# Altium project MD029A.PrjPcb (part 1 of 3)
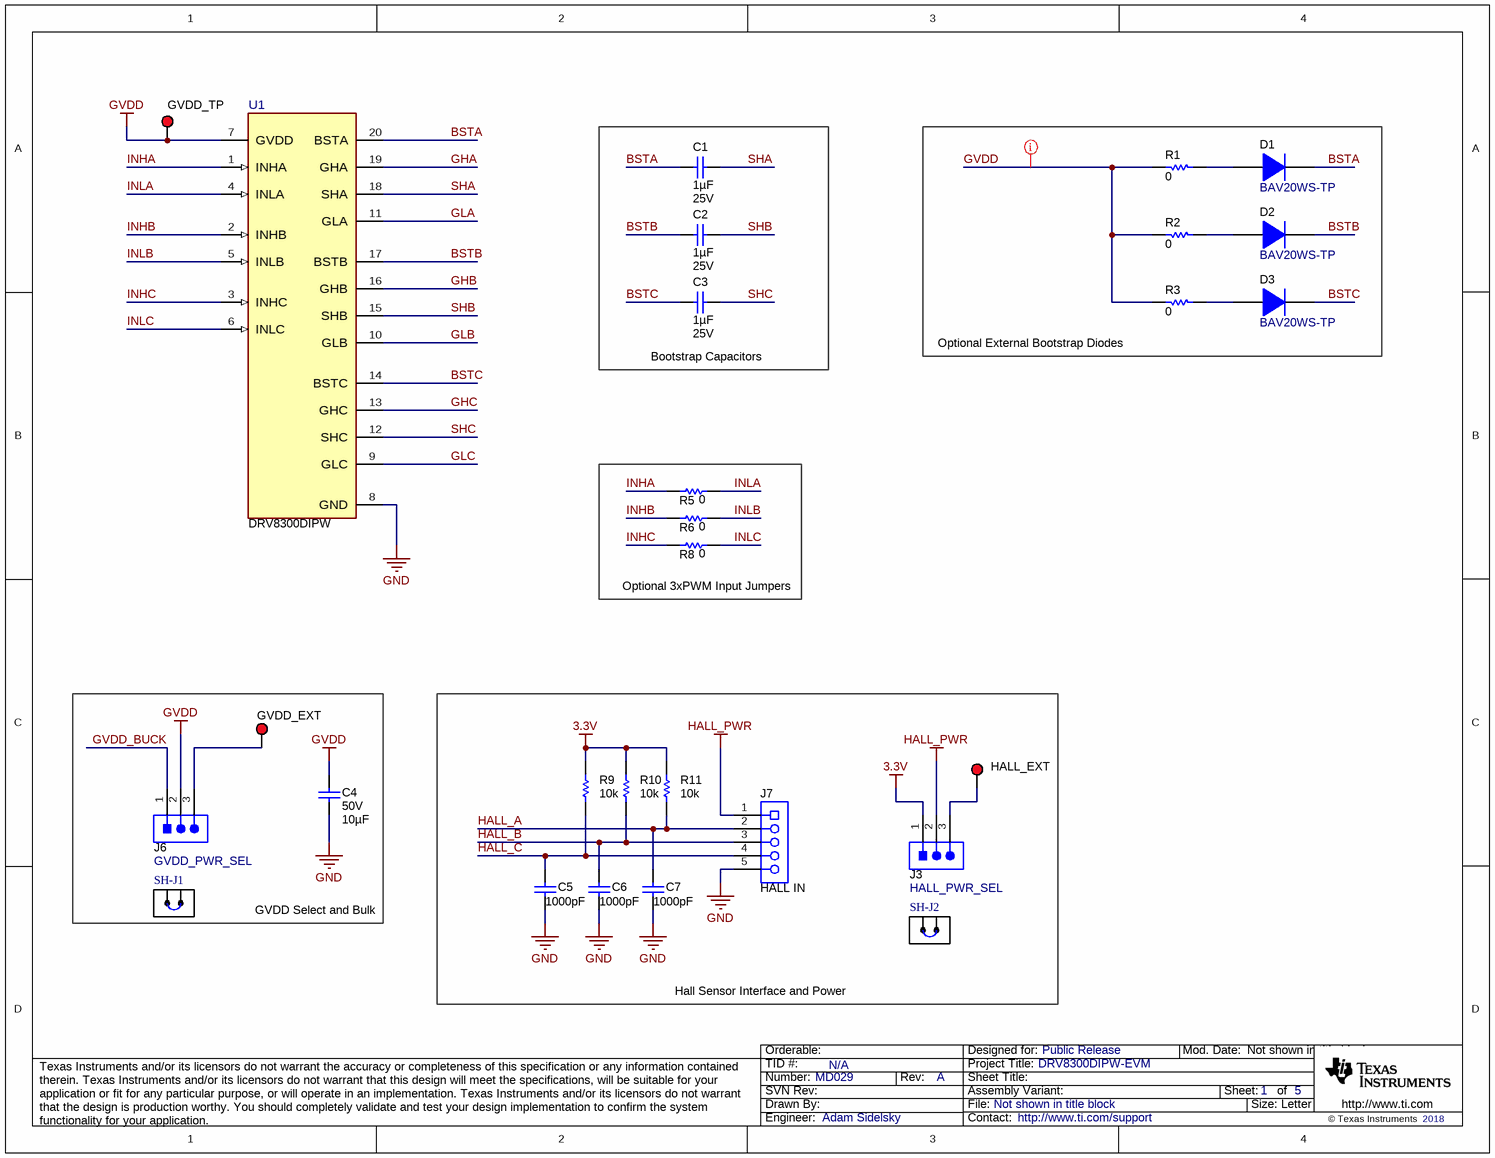
[diagram p0: MD029A_DRV8300.SchDoc]
CopyrightYear: 2018; PCB_Layout: Adam Sidelsky; PCB_Rev: A; PRJ_Customer: Public Release; PRJ_Engineer: Adam Sidelsky; PRJ_Number: MD029; PRJ_Title: DRV8300DIPW-EVM; SCH_Rev: A; TechSupport: http://www.ti.com/support; TID: N/A
5 sheets, 226 parts. Net scope: global (net labels, ports and power ports of the same name join across sheets).
Board file: MD029A.PcbDoc
Sheets:
  MD029A_DRV8300.SchDoc
  MD029A_HalfBridges.SchDoc
  MD029A_CSA.SchDoc
  MD029A_Power.SchDoc
  MD029A_Hardware.SchDoc

## Sheet MD029A_DRV8300.SchDoc
size Letter; Date: Not shown in title block; ApprovedBy: Not shown in title block; CheckedBy: Not shown in title block; Author: Not shown in title block; CompanyName: Not shown in title block; Engineer: Not shown in title block; Organization: Not shown in title block; Address1: Not shown in title block; Address2: Not shown in title block; Address3: Not shown in title block; Address4: Not shown in title block; DocumentNumber: 1; Revision: Use project parameter SCH_Rev; SheetNumber: 1; SheetTotal: 5; PageSetup: Record=PageOptions|CenterHorizontal=True|CenterVertical=True|PrintScale=1.00|XCorrection=1.00|YCorrection=1.00|PrintKind=0|BorderSize=5000000|LeftOffset=0|BottomOffset=0|Orientation=2|PaperLength=1000|PaperWidth=1000|Scale=100|PaperSource=15|PrintQuality=600|MediaType=1|DitherType=10|PaperKind=Letter|PrintScaleMode=1; CurrentTime: Not shown in title block; CurrentDate: Not shown in title block; Time: Not shown in title block; DocumentFullPathAndName: Not shown in title block; DocumentName: Not shown in title block; ModifiedDate: Not shown in title block; ImagePath: Not shown in title block

### Parts
C1  Cap_F: 1µF  VDC_V: 25V  [0805L]  (hidden comment: CL21B105KAFNNNE)
C2  Cap_F: 1µF  VDC_V: 25V  [0805L]  (hidden comment: CL21B105KAFNNNE)
C3  Cap_F: 1µF  VDC_V: 25V  [0805L]  (hidden comment: CL21B105KAFNNNE)
C4  VDC_V: 50V  ValueDisplayed: 10µF  [1210_270L]  (hidden comment: CL32B106KBJNNWE)
C5  ValueDisplayed: 1000pF  [0603L]  (hidden comment: 885012206034)
C6  ValueDisplayed: 1000pF  [0603L]  (hidden comment: 885012206034)
C7  ValueDisplayed: 1000pF  [0603L]  (hidden comment: 885012206034)
D1  BAV20WS-TP  [SOD-323]
D2  BAV20WS-TP  [SOD-323]
D3  BAV20WS-TP  [SOD-323]
GVDD_EXT  (no value)  [Keystone5000]
GVDD_TP  (no value)  [Keystone5000]
HALL_EXT  (no value)  [Keystone5000]
J3  HALL_PWR_SEL  [WURTH_61300311121]
J6  GVDD_PWR_SEL  [WURTH_61300311121]
J7  HALL IN  [Phoenix_1792892]
R1  ValueDisplayed: 0  [0805L]  (hidden comment: CRCW08050000Z0EAHP)
R2  ValueDisplayed: 0  [0805L]  (hidden comment: CRCW08050000Z0EAHP)
R3  ValueDisplayed: 0  [0805L]  (hidden comment: CRCW08050000Z0EAHP)
R5  value 0  [0603L]  (hidden comment: CRCW06030000Z0EA)
R6  value 0  [0603L]  (hidden comment: CRCW06030000Z0EA)
R8  value 0  [0603L]  (hidden comment: CRCW06030000Z0EA)
R9  value 10k  [0603L]  (hidden comment: CRCW060310K0JNEA)
R10  value 10k  [0603L]  (hidden comment: CRCW060310K0JNEA)
R11  value 10k  [0603L]  (hidden comment: CRCW060310K0JNEA)
SH-J1  SNT-100-BK-G  [SNT-100-BK-G]  (value not drawn)
SH-J2  SNT-100-BK-G  [SNT-100-BK-G]  (value not drawn)
U1  DRV8300DIPW  [PW0020A-MFG]

### Blocks framed on the sheet
Bootstrap Capacitors: C1-C3
Optional External Bootstrap Diodes: D1-D3 R1-R3
Optional 3xPWM Input Jumpers: R5 R6 R8
GVDD Select and Bulk: C4 GVDD_EXT J6 SH-J1
Hall Sensor Interface and Power: C5-C7 HALL_EXT J3 J7 R9-R11 SH-J2

### Nets
3.3V: J3.1 R9.1 R10.1 R11.1
GND: C4.2 C5.2 C6.2 C7.2 J7.5 U1.8(GND)
GVDD: C4.1 GVDD_TP.1 J6.2 R1.2 R2.2 R3.2 U1.7(GVDD)
HALL_PWR: J3.2 J7.1
BSTA: C1.2 D1.1(K) U1.20(BSTA)
BSTB: C2.2 D2.1(K) U1.17(BSTB)
BSTC: C3.2 D3.1(K) U1.14(BSTC)
GHA: U1.19(GHA)
GHB: U1.16(GHB)
GHC: U1.13(GHC)
GLA: U1.11(GLA)
GLB: U1.10(GLB)
GLC: U1.9(GLC)
GVDD_BUCK: J6.1
HALL_A: C7.1 J7.2 R11.2
HALL_B: C6.1 J7.3 R10.2
HALL_C: C5.1 J7.4 R9.2
INHA: R5.2 U1.1(INHA)
INHB: R6.2 U1.2(INHB)
INHC: R8.2 U1.3(INHC)
INLA: R5.1 U1.4(INLA)
INLB: R6.1 U1.5(INLB)
INLC: R8.1 U1.6(INLC)
SHA: C1.1 U1.18(SHA)
SHB: C2.1 U1.15(SHB)
SHC: C3.1 U1.12(SHC)
NetD1_2: D1.2(A) R1.1
NetD2_2: D2.2(A) R2.1
NetD3_2: D3.2(A) R3.1
NetGVDD_EXT_1: GVDD_EXT.1 J6.3
NetHALL_EXT_1: HALL_EXT.1 J3.3

### Layout directives
net class 2.5A: GVDD

### Notes on the sheet
- Drawn By:
- SVN Rev:
- Number:
- TID #:
- Orderable:
- Rev:
- Sheet Title:
- File:
- Project Title:
- Designed for:
- Assembly Variant:
- Mod. Date:
- Sheet:
- Size:
- of
- Letter
- http://www.ti.com
- Texas Instruments and/or its licensors do not warrant the accuracy or completeness of this specification or any information contained therein. Texas Instruments and/or its licensors do not warrant that this design will meet the specifications, will be suitable for your application or fit for any particular purpose, or will operate in an implementation. Texas Instruments and/or its licensors do not warrant that the design is production worthy. You should completely validate and test your design implementation to confirm the system functionality for your application.
- Engineer:
- Contact:
- © Texas Instruments

### Library data of the parts
C1-C3 = CMP-0083859-1: CAP, CERM, 1 µF, 25 V,+/- 10%, X7R, 0805; Manufacturer: Samsung Electro-Mechanics; TaMin_C: -55°C; Polarized: N; Green_Lifecycle: Active; SizeAreaWB_mm2: 6.75; Green_REACh: Passed; U/M: EA; Value: 1uF; TaMax_C: 125°C; SizeZ_mm: 1.45; SizeX_mm: 2; SizeY_mm: 1.25; Cap_Case: 0805; SizeArea_mm2: 2.5; AEC Category: Q200; ComponentLink1URL: http://www.samsungsem.com/kr/support/product-search/mlcc/CL21B105KAFNNNE.jsp; TempCo: X7R; RoHS: Y; MountType: SMT; Green_EU RoHS-2: Passed; Green_EU RoHS: Passed; PackageReference: 0805; Tolerance_%: 10%; Value2: 25V; CompType: Capacitor; PartNumber: CL21B105KAFNNNE; AEC Qualified: N; ComponentLink1Description: Datasheet link; AEC Grade: N/A; Technology: Ceramic; ValueDisplayed: 1µF
C4 = CMP-0079201-1: CAP, CERM, 10 µF, 50 V,+/- 10%, X7R, 1210; Manufacturer: Samsung Electro-Mechanics; TaMin_C: -55°C; ESR_ohm: 5m; Polarized: N; SizeAreaWB_mm2: 14.7; Value1: 0.005 ohm; U/M: EA; Value: 10uF; TaMax_C: 125°C; SizeZ_mm: 2.7; SizeX_mm: 3.2; SizeY_mm: 2.5; Cap_Case: 1210; SizeArea_mm2: 8; AEC Category: Q200; ComponentLink1URL: http://www.samsungsem.com/kr/support/product-search/mlcc/__icsFiles/afieldfile/2016/08/18/S_CL32B106KBJNNWE.pdf; TempCo: X7R; RoHS: Y; MountType: SMT; Supplier 1: Digi-Key; PackageReference: 1210; Tolerance_%: 10%; Value2: 50V; CompType: Capacitor; PartNumber: CL32B106KBJNNWE; AEC Qualified: N; Cap_F: 10µF; ComponentLink1Description: Datasheet link; AEC Grade: N/A; Supplier Part Number 1: 1276-3388-1-ND; Technology: Ceramic
C5-C7 = CMP-0006826-4: CAP, CERM, 1000 pF, 16 V, +/- 10%, X7R, 0603; Manufacturer: Wurth Elektronik; TaMin_C: -55°C; Polarized: N; SizeAreaWB_mm2: 4.68; Value1: Unknown; U/M: EA; Value: 1000pF; TaMax_C: 125°C; SizeZ_mm: 1; SizeX_mm: 1.6; SizeY_mm: 0.8; Cap_Case: 0603; Value2: 16V; SizeArea_mm2: 1.28; CompType: Capacitor; Cap_F: 1nF; AEC Category: Q200; Publisher: Texas Instruments; TempCo: X7R; Published: 2008-06-19; RoHS: Y; MountType: SMT; Supplier 1: Mouser; PackageReference: 0603; Tolerance_%: 10%; LatestRevisionDate: 2017-03-09; PartNumber: 885012206034; AEC Qualified: N; ComponentLink1Description: Datasheet link; AEC Grade: N/A; Supplier Part Number 1: 710-885012206034; Technology: Ceramic; ComponentLink1URL: http://katalog.we-online.de/pbs/datasheet/885012206034.pdf
D1-D3 = CMP-0029044-2: Diode, P-N, 150 V, 0.2 A, SOD-323; Manufacturer: Micro Commercial Components; Value2: 1.25V; AEC Category: Q101; SizeArea_mm2: 3.645; Vr_V: 150V; Green_REACh: Incomplete; SizeZ_mm: 1; Green_Lifecycle: Not Set; TJmax_C: 150°C; SizeAreaWB_mm2: 8.695; Value1: 0.2A; SizeX_mm: 2.7; Io_A: 200mA; SizeY_mm: 1.35; Value: 150V; PartNumber: BAV20WS-TP; AEC Qualified: ?; ComponentLink1URL: http://www.mccsemi.com/up_pdf/BAV19WS-BAV21WS(SOD-323).PDF; PackageReference: SOD-323; Vf_V: 1.25V; RoHS: Y; CompType: Diode; MountType: SMT; Type: P-N; Green_EU RoHS-2: Incomplete; Green_EU RoHS: Incomplete; ComponentLink1Description: Datasheet link
GVDD_EXT GVDD_TP HALL_EXT = CMP-0055137-1: Test Point, Miniature, Red, TH; PartNumber: 5000; Manufacturer: Keystone; ContactFinish: Silver; CNHeader: FALSE; CT: TRUE; Green_Lifecycle: Active; Green_REACh: Passed; PackageReference: Red Miniature Testpoint; CompType: Test Point; RoHS: Y; MountType: TH; ComponentLink1Description: Datasheet URL; ComponentLink1URL: http://www.keyelco.com/userAssets/file/M60-2p60.pdf; Publisher: Texas Instruments; LatestRevisionDate: 26/05/2017; Supplier 1: Digi-Key; Supplier Part Number 1: 36-5000-ND; Supplier 2: Mouser; Supplier Part Number 2: 534-5000; Color: Red; Green_EU RoHS-2: Incomplete; Green_EU RoHS: Passed
J3 J6 = CMP-0054796-2: Header, 2.54 mm, 3x1, Gold, TH; Manufacturer: Wurth Elektronik; PartNumber: 61300311121; Green_Lifecycle: Active; Green_REACh: Passed; Cert_UL: Y; Gender: Male; Pitch_mm: 2.54; Row_Count: 1; Shrouded: N; ComponentLink1URL: http://katalog.we-online.de/em/datasheet/6130xx11121.pdf; ClassName: Header; Supplier Part Number 2: 20X0950; Supplier 2: Newark; Supplier Part Number 3: 356154; Supplier 3: Farnell; RoHS: Y; MountType: TH; Green_EU RoHS-2: Incomplete; Supplier 1: Digi-Key; Green_EU RoHS: Passed; PackageReference: Header, 2.54mm, 3x1, TH; CompType: Header; ComponentLink1Description: Datasheet URL; Supplier Part Number 1: 732-5316-ND; Color: Black; ContactFinish: Gold; Orientation: Vertical; PinCount: 3
J7 = CMP-0055532-1: Terminal Block, 5mm, 5x1, R/A, TH; Manufacturer: Phoenix Contact; PartNumber: 1792892; Cert_VDE: Y; CNHeader: FALSE; Current_A: 16A; Gender: Female; Voltage_V: 400V; Row_Count: 1; Pitch_mm: 5; CT: TRUE; ComponentLink1URL: https://www.phoenixcontact.com/online/portal/pi?uri=pxc-oc-itemdetail:pid=1792892&library=pien&pcck=P-11-01-05&tab=1; Supplier Part Number 2: 78T0423; Publisher: Texas Instruments; Supplier 2: Newark; Supplier Part Number 3: 651-1792892; Color: Green; Supplier 3: Mouser; Cert_CULUS: Y; RoHS: Y; MountType: TH; Supplier 1: Digi-Key; PackageReference: Terminal Block, 5mm, 5x1, R/A, TH; PinCount: 5; CompType: Terminal Block; LatestRevisionDate: 26/05/2017; Orientation: R/A; ComponentLink1Description: Datasheet URL; Supplier Part Number 1: 277-2521-ND; Cert_UL: Y
R1-R3 = CMP-0020443-3: RES, 0, 5%, 0.333 W, AEC-Q200 Grade 0, 0805; Manufacturer: Vishay-Dale; Power_W: 333mW; TempCo: 200 ppm/C; Value_Code: 0000; Value: 0; EIA_Code: E24; SizeX_mm: 2; SizeY_mm: 1.25; SizeZ_mm: 1.45; Value2: 0.333W; SizeArea_mm2: 2.5; AEC Qualified: Y; AEC Category: Q200; VDC_V: 150V; Supplier Part Number 2: 68R2993; Supplier 2: Newark; Supplier Part Number 3: 71-CRCW08050000Z0EAH; Supplier 3: Mouser; RoHS: E; Value1: 5%; MountType: SMT; Supplier 1: Digi-Key; PackageReference: 0805; Tolerance_%: 5%; Res_ohm: 0; CompType: Resistor; PartNumber: CRCW08050000Z0EAHP; ComponentLink1Description: Datasheet link; Supplier Part Number 1: 541-0.0TBCT-ND; Technology: Thick Film; ComponentLink1URL: http://www.vishay.com/docs/20043/crcwhpe3.pdf; AEC Grade: 0
R5 R6 R8 = CMP-0025697-4: RES, 0, 5%, 0.1 W, AEC-Q200 Grade 0, 0603; Manufacturer: Vishay-Dale; Value_Code: 0000; Power_W: 100mW; Value2: 0.1W; VDC_V: 75V; TempCo: 200 ppm/C; EIA_Code: E24; AEC Category: Q200; AEC Qualified: Y; SizeArea_mm2: 1.28; SizeX_mm: 1.6; SizeY_mm: 0.8; SizeZ_mm: 1; CompType: Resistor; PartNumber: CRCW06030000Z0EA; PackageReference: 0603; RoHS: E; Res_ohm: 0; Tolerance_%: 5%; Value1: 5%; MountType: SMT; Technology: Thick Film; ComponentLink1Description: Datasheet link; ComponentLink1URL: http://www.vishay.com/docs/20035/dcrcwe3.pdf; Supplier 1: Digi-Key; Supplier Part Number 1: 541-0.0GCT-ND; Supplier 2: Newark; Supplier Part Number 2: 52K8014; Supplier 3: Mouser; Supplier Part Number 3: 71-CRCW0603-0-E3; ValueDisplayed: 0; AEC Grade: 0
R9-R11 = CMP-0025701-4: RES, 10 k, 5%, 0.1 W, AEC-Q200 Grade 0, 0603; Manufacturer: Vishay-Dale; Value_Code: 10k0; Power_W: 100mW; Value2: 0.1W; VDC_V: 75V; TempCo: 200 ppm/C; EIA_Code: E24; AEC Category: Q200; AEC Qualified: Y; AEC Grade: 0; SizeArea_mm2: 1.28; SizeX_mm: 1.6; SizeY_mm: 0.8; SizeZ_mm: 1; CompType: Resistor; PartNumber: CRCW060310K0JNEA; PackageReference: 0603; RoHS: E; Res_ohm: 10k; Tolerance_%: 5%; Value1: 5%; MountType: SMT; Technology: Thick Film; ComponentLink1Description: Datasheet link; ComponentLink1URL: http://www.vishay.com/docs/20035/dcrcwe3.pdf; Supplier 1: Digi-Key; Supplier Part Number 1: 541-10KGCT-ND; Supplier 2: Newark; Supplier Part Number 2: 52K8066; Supplier 3: Mouser; Supplier Part Number 3: 71-CRCW0603J-10K-E3; ValueDisplayed: 10k
SH-J1 SH-J2 = CMP-0003623-3: Shunt, 100mil, Gold plated, Black; Alternate PartNumber: 969102-0000-DA; Manufacturer: Samtec; Alternate Manufacturer: 3M; Value: 1x2; ComponentLink1URL: http://www.samtec.com/ftppub/pdf/SNT.PDF; Supplier 1: Digi-Key; CompType: Shunt; PackageReference: Shunt; ClassName: Shunt; RoHS: Y; Supplier Part Number 1: SAM8858-ND; MountType: N/A; PartNumber: SNT-100-BK-G; ComponentLink1Description: Datasheet Link
U1 = CMP-0089052-1: Three-Phase BLDC Gate Driver; Manufacturer: Texas Instruments; AEC Qualified: No; SizeZ_mm: 1.2mm; Operating Temperature Range: -40°C to +150°C; PartNumber: DRV8300DIPW; RoHS: UNKNOWN; PackageReference: TSSOP20

## Sheet MD029A_HalfBridges.SchDoc
size Letter; Date: Not shown in title block; ApprovedBy: Not shown in title block; CheckedBy: Not shown in title block; Author: Not shown in title block; CompanyName: Not shown in title block; Engineer: Not shown in title block; Organization: Not shown in title block; Address1: Not shown in title block; Address2: Not shown in title block; Address3: Not shown in title block; Address4: Not shown in title block; DocumentNumber: 2; Revision: Use project parameter SCH_Rev; SheetNumber: 2; SheetTotal: 5; PageSetup: Record=PageOptions|CenterHorizontal=True|CenterVertical=True|PrintScale=1.00|XCorrection=1.00|YCorrection=1.00|PrintKind=0|BorderSize=5000000|LeftOffset=0|BottomOffset=0|Orientation=2|PaperLength=1000|PaperWidth=1000|Scale=100|PaperSource=15|PrintQuality=600|MediaType=1|DitherType=10|PaperKind=Letter|PrintScaleMode=1; CurrentTime: Not shown in title block; CurrentDate: Not shown in title block; Time: Not shown in title block; DocumentFullPathAndName: Not shown in title block; DocumentName: Not shown in title block; ModifiedDate: Not shown in title block; ImagePath: Not shown in title block
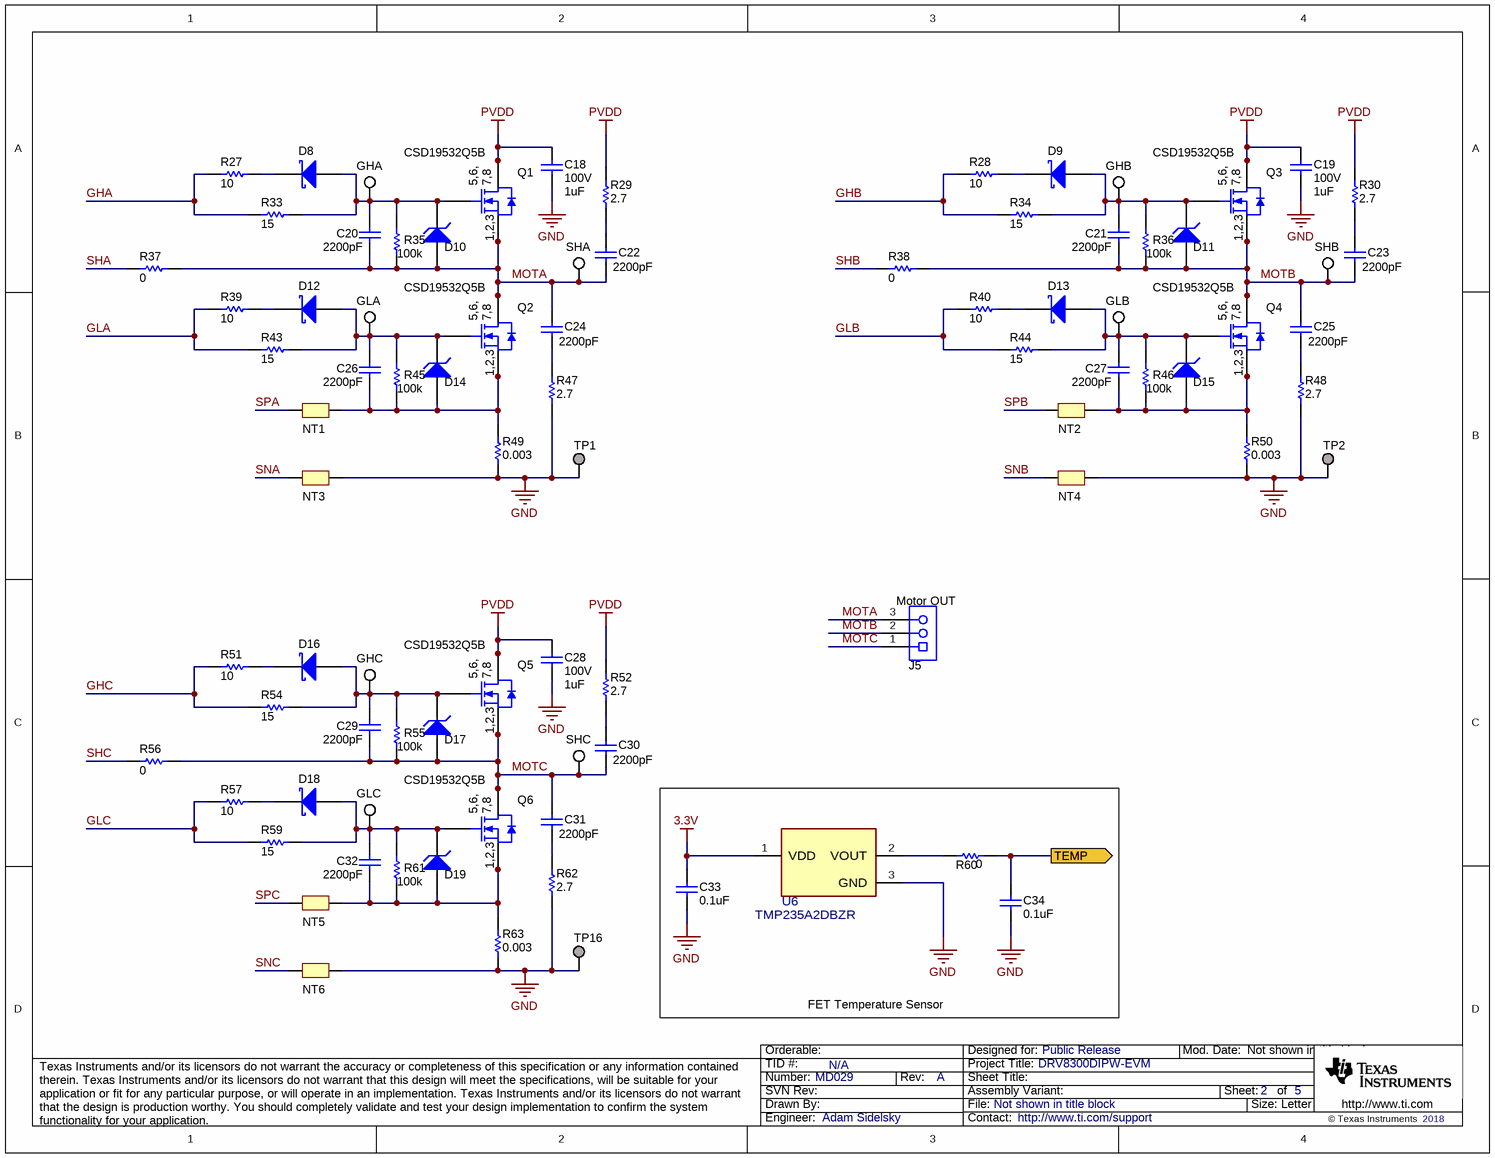
[diagram p1: MD029A_HalfBridges.SchDoc]

### Parts
C18  VDC_V: 100V  ValueDisplayed: 1uF  [1210_220L]  (hidden comment: CGA6M2X7R2A105K200AA)
C19  VDC_V: 100V  ValueDisplayed: 1uF  [1210_220L]  (hidden comment: CGA6M2X7R2A105K200AA)
C20  ValueDisplayed: 2200pF  [0603L]  (hidden comment: 06031C222KAT2A)
C21  ValueDisplayed: 2200pF  [0603L]  (hidden comment: 06031C222KAT2A)
C22  ValueDisplayed: 2200pF  [0603L]  (hidden comment: GRM188R72A222KA01D)
C23  ValueDisplayed: 2200pF  [0603L]  (hidden comment: GRM188R72A222KA01D)
C24  ValueDisplayed: 2200pF  [0603L]  (hidden comment: GRM188R72A222KA01D)
C25  ValueDisplayed: 2200pF  [0603L]  (hidden comment: GRM188R72A222KA01D)
C26  ValueDisplayed: 2200pF  [0603L]  (hidden comment: 06031C222KAT2A)
C27  ValueDisplayed: 2200pF  [0603L]  (hidden comment: 06031C222KAT2A)
C28  VDC_V: 100V  ValueDisplayed: 1uF  [1210_220L]  (hidden comment: CGA6M2X7R2A105K200AA)
C29  ValueDisplayed: 2200pF  [0603L]  (hidden comment: 06031C222KAT2A)
C30  ValueDisplayed: 2200pF  [0603L]  (hidden comment: GRM188R72A222KA01D)
C31  ValueDisplayed: 2200pF  [0603L]  (hidden comment: GRM188R72A222KA01D)
C32  ValueDisplayed: 2200pF  [0603L]  (hidden comment: 06031C222KAT2A)
C33  ValueDisplayed: 0.1uF  [0603L]  (hidden comment: C0603C104J4RACTU)
C34  ValueDisplayed: 0.1uF  [0603L]  (hidden comment: C0603C104J4RACTU)
D8  SSA24-E3/61T  [SMA]  (value not drawn)
D9  SSA24-E3/61T  [SMA]  (value not drawn)
D10  SMAZ16-13-F  [SMA]  (value not drawn)
D11  SMAZ16-13-F  [SMA]  (value not drawn)
D12  SSA24-E3/61T  [SMA]  (value not drawn)
D13  SSA24-E3/61T  [SMA]  (value not drawn)
D14  SMAZ16-13-F  [SMA]  (value not drawn)
D15  SMAZ16-13-F  [SMA]  (value not drawn)
D16  SSA24-E3/61T  [SMA]  (value not drawn)
D17  SMAZ16-13-F  [SMA]  (value not drawn)
D18  SSA24-E3/61T  [SMA]  (value not drawn)
D19  SMAZ16-13-F  [SMA]  (value not drawn)
GHA  5002  [Keystone5002]  (value not drawn)
GHB  5002  [Keystone5002]  (value not drawn)
GHC  5002  [Keystone5002]  (value not drawn)
GLA  5002  [Keystone5002]  (value not drawn)
GLB  5002  [Keystone5002]  (value not drawn)
GLC  5002  [Keystone5002]  (value not drawn)
J5  Motor OUT  [Phoenix_1904150]
NT1  Net-Tie  [Net-Tie_10mil]  (value not drawn)  (net tie, no BOM)
NT2  Net-Tie  [Net-Tie_10mil]  (value not drawn)  (net tie, no BOM)
NT3  Net-Tie  [Net-Tie_10mil]  (value not drawn)  (net tie, no BOM)
NT4  Net-Tie  [Net-Tie_10mil]  (value not drawn)  (net tie, no BOM)
NT5  Net-Tie  [Net-Tie_10mil]  (value not drawn)  (net tie, no BOM)
NT6  Net-Tie  [Net-Tie_10mil]  (value not drawn)  (net tie, no BOM)
Q1  CSD19532Q5B  [DNK0008A]
Q2  CSD19532Q5B  [DNK0008A]
Q3  CSD19532Q5B  [DNK0008A]
Q4  CSD19532Q5B  [DNK0008A]
Q5  CSD19532Q5B  [DNK0008A]
Q6  CSD19532Q5B  [DNK0008A]
R27  ValueDisplayed: 10  [0805L]  (hidden comment: ERJ-6GEYJ100V)
R28  ValueDisplayed: 10  [0805L]  (hidden comment: ERJ-6GEYJ100V)
R29  ValueDisplayed: 2.7  [0805L]  (hidden comment: CRCW08052R70JNEA)
R30  ValueDisplayed: 2.7  [0805L]  (hidden comment: CRCW08052R70JNEA)
R33  ValueDisplayed: 15  [0805L]  (hidden comment: ERJ-6GEYJ150V)
R34  ValueDisplayed: 15  [0805L]  (hidden comment: ERJ-6GEYJ150V)
R35  ValueDisplayed: 100k  [0603L]  (hidden comment: CRCW0603100KFKEA)
R36  ValueDisplayed: 100k  [0603L]  (hidden comment: CRCW0603100KFKEA)
R37  ValueDisplayed: 0  [0603L]  (hidden comment: RCS06030000Z0EA)
R38  ValueDisplayed: 0  [0603L]  (hidden comment: RCS06030000Z0EA)
R39  ValueDisplayed: 10  [0805L]  (hidden comment: ERJ-6GEYJ100V)
R40  ValueDisplayed: 10  [0805L]  (hidden comment: ERJ-6GEYJ100V)
R43  ValueDisplayed: 15  [0805L]  (hidden comment: ERJ-6GEYJ150V)
R44  ValueDisplayed: 15  [0805L]  (hidden comment: ERJ-6GEYJ150V)
R45  ValueDisplayed: 100k  [0603L]  (hidden comment: CRCW0603100KFKEA)
R46  ValueDisplayed: 100k  [0603L]  (hidden comment: CRCW0603100KFKEA)
R47  ValueDisplayed: 2.7  [0805L]  (hidden comment: CRCW08052R70JNEA)
R48  ValueDisplayed: 2.7  [0805L]  (hidden comment: CRCW08052R70JNEA)
R49  ValueDisplayed: 0.003  [CRE2512-R1_R4]  (hidden comment: CRE2512-FZ-R003E-3)
R50  ValueDisplayed: 0.003  [CRE2512-R1_R4]  (hidden comment: CRE2512-FZ-R003E-3)
R51  ValueDisplayed: 10  [0805L]  (hidden comment: ERJ-6GEYJ100V)
R52  ValueDisplayed: 2.7  [0805L]  (hidden comment: CRCW08052R70JNEA)
R54  ValueDisplayed: 15  [0805L]  (hidden comment: ERJ-6GEYJ150V)
R55  ValueDisplayed: 100k  [0603L]  (hidden comment: CRCW0603100KFKEA)
R56  ValueDisplayed: 0  [0603L]  (hidden comment: RCS06030000Z0EA)
R57  ValueDisplayed: 10  [0805L]  (hidden comment: ERJ-6GEYJ100V)
R59  ValueDisplayed: 15  [0805L]  (hidden comment: ERJ-6GEYJ150V)
R60  value 0  [0603L]  (hidden comment: CRCW06030000Z0EA)
R61  ValueDisplayed: 100k  [0603L]  (hidden comment: CRCW0603100KFKEA)
R62  ValueDisplayed: 2.7  [0805L]  (hidden comment: CRCW08052R70JNEA)
R63  ValueDisplayed: 0.003  [CRE2512-R1_R4]  (hidden comment: CRE2512-FZ-R003E-3)
SHA  5002  [Keystone5002]  (value not drawn)
SHB  5002  [Keystone5002]  (value not drawn)
SHC  5002  [Keystone5002]  (value not drawn)
TP1  TP_SM_1MM  [TP_SM_1MM]  (value not drawn)  (no BOM)
TP2  TP_SM_1MM  [TP_SM_1MM]  (value not drawn)  (no BOM)
TP16  TP_SM_1MM  [TP_SM_1MM]  (value not drawn)  (no BOM)
U6  TMP235A2DBZR  [DBZ0003A-MFG]

### Blocks framed on the sheet
FET Temperature Sensor: C33 C34 R60 U6

### Ports
TEMP (out)

### Nets
3.3V: C33.1 U6.1(VDD)
GND: C18.2 C19.2 C28.2 C33.2 C34.2 NT3.2 NT4.2 NT6.2 R47.1 R48.1 R49.1 R50.1 R62.1 R63.1 TP1.1 TP2.1 TP16.1 U6.3(GND)
PVDD: C18.1 C19.1 C28.1 Q1.5(D) Q1.6(D) Q1.7(D) Q1.8(D) Q1.9(D) Q3.5(D) Q3.6(D) Q3.7(D) Q3.8(D) Q3.9(D) Q5.5(D) Q5.6(D) Q5.7(D) Q5.8(D) Q5.9(D) R29.2 R30.2 R52.2
GHA: R27.1 R33.1
GHB: R28.1 R34.1
GHC: R51.1 R54.1
GLA: R39.1 R43.1
GLB: R40.1 R44.1
GLC: R57.1 R59.1
MOTA: C20.2 C22.2 C24.1 D10.2(A) J5.3 Q1.1(S) Q1.2(S) Q1.3(S) Q2.5(D) Q2.6(D) Q2.7(D) Q2.8(D) Q2.9(D) R35.2 R37.2 SHA.1
MOTB: C21.2 C23.2 C25.1 D11.2(A) J5.2 Q3.1(S) Q3.2(S) Q3.3(S) Q4.5(D) Q4.6(D) Q4.7(D) Q4.8(D) Q4.9(D) R36.2 R38.2 SHB.1
MOTC: C29.2 C30.2 C31.1 D17.2(A) J5.1 Q5.1(S) Q5.2(S) Q5.3(S) Q6.5(D) Q6.6(D) Q6.7(D) Q6.8(D) Q6.9(D) R55.2 R56.2 SHC.1
SHA: R37.1
SHB: R38.1
SHC: R56.1
SNA: NT3.1
SNB: NT4.1
SNC: NT6.1
SPA: NT1.1
SPB: NT2.1
SPC: NT5.1
TEMP: C34.1 R60.1 ; port TEMP
NetC20_1: C20.1 D8.2(A) D10.1(K) GHA.1 Q1.4(G) R33.2 R35.1
NetC21_1: C21.1 D9.2(A) D11.1(K) GHB.1 Q3.4(G) R34.2 R36.1
NetC22_1: C22.1 R29.1
NetC23_1: C23.1 R30.1
NetC24_2: C24.2 R47.2
NetC25_2: C25.2 R48.2
NetC26_1: C26.1 D12.2(A) D14.1(K) GLA.1 Q2.4(G) R43.2 R45.1
NetC26_2: C26.2 D14.2(A) NT1.2 Q2.1(S) Q2.2(S) Q2.3(S) R45.2 R49.2
NetC27_1: C27.1 D13.2(A) D15.1(K) GLB.1 Q4.4(G) R44.2 R46.1
NetC27_2: C27.2 D15.2(A) NT2.2 Q4.1(S) Q4.2(S) Q4.3(S) R46.2 R50.2
NetC29_1: C29.1 D16.2(A) D17.1(K) GHC.1 Q5.4(G) R54.2 R55.1
NetC30_1: C30.1 R52.1
NetC31_2: C31.2 R62.2
NetC32_1: C32.1 D18.2(A) D19.1(K) GLC.1 Q6.4(G) R59.2 R61.1
NetC32_2: C32.2 D19.2(A) NT5.2 Q6.1(S) Q6.2(S) Q6.3(S) R61.2 R63.2
NetD8_1: D8.1(K) R27.2
NetD9_1: D9.1(K) R28.2
NetD12_1: D12.1(K) R39.2
NetD13_1: D13.1(K) R40.2
NetD16_1: D16.1(K) R51.2
NetD18_1: D18.1(K) R57.2
NetR60_2: R60.2 U6.2(VOUT)

### Notes on the sheet
- Drawn By:
- SVN Rev:
- Number:
- TID #:
- Orderable:
- Rev:
- Sheet Title:
- File:
- Project Title:
- Designed for:
- Assembly Variant:
- Mod. Date:
- Sheet:
- Size:
- of
- Letter
- http://www.ti.com
- Texas Instruments and/or its licensors do not warrant the accuracy or completeness of this specification or any information contained therein. Texas Instruments and/or its licensors do not warrant that this design will meet the specifications, will be suitable for your application or fit for any particular purpose, or will operate in an implementation. Texas Instruments and/or its licensors do not warrant that the design is production worthy. You should completely validate and test your design implementation to confirm the system functionality for your application.
- Engineer:
- Contact:
- © Texas Instruments
- (in symbol CMP-0000958-3) 5,6,; 7,8; 1,2,3

### Library data of the parts
C18 C19 C28 = CMP-0009145-2: CAP, CERM, 1 uF, 100 V, +/- 10%, X7R, AEC-Q200 Grade 1, 1210; Manufacturer: TDK; TaMin_C: -55°C; ESR_ohm: 4.956m; Polarized: N; SizeAreaWB_mm2: 14.7; Value1: 0.004956 ohm; U/M: EA; Value: 1uF; TaMax_C: 125°C; SizeZ_mm: 2.2; SizeX_mm: 3.2; SizeY_mm: 2.5; Cap_Case: 1210_220; SizeArea_mm2: 8; AEC Qualified: Y; Cap_F: 1µF; IRMS_A: 3.30731A; AEC Grade: 1; AEC Category: Q200; Supplier Part Number 2: 810-CGA6M2X7R2A105K200AA; Publisher: Texas Instruments; Supplier 2: Mouser; TempCo: X7R; Published: 2008-06-19; RoHS: Y; MountType: SMT; Supplier 1: Digi-Key; PackageReference: 1210; Tolerance_%: 10%; Value2: 100V; CompType: Capacitor; LatestRevisionDate: 2017-03-09; PartNumber: CGA6M2X7R2A105K200AA; ComponentLink1Description: Datasheet link; Supplier Part Number 1: 445-5865-1-ND; Technology: Ceramic; ComponentLink1URL: https://product.tdk.com/en/search/capacitor/ceramic/mlcc/info?part_no=CGA6M2X7R2A105K200AA
C20 C21 C26 C27 C29 C32 = CMP-0006737-4: CAP, CERM, 2200 pF, 100 V, +/- 10%, X7R, 0603; Manufacturer: AVX; TaMin_C: -55°C; ESR_ohm: 1.92d; Polarized: N; SizeAreaWB_mm2: 4.68; Value1: 0.192 ohm; U/M: EA; Value: 2200pF; TaMax_C: 125°C; SizeZ_mm: 1; SizeX_mm: 1.6; SizeY_mm: 0.8; Cap_Case: 0603; Value2: 100V; SizeArea_mm2: 1.28; CompType: Capacitor; Cap_F: 2.2nF; AEC Category: Q200; Supplier Part Number 2: 96K4759; Publisher: Texas Instruments; Supplier 2: Newark; Supplier Part Number 3: 581-06031C222K; TempCo: X7R; Supplier 3: Mouser; Published: 2008-06-19; RoHS: Y; MountType: SMT; Supplier 1: Digi-Key; PackageReference: 0603; Tolerance_%: 10%; LatestRevisionDate: 2017-03-09; PartNumber: 06031C222KAT2A; AEC Qualified: N; ComponentLink1Description: Datasheet link; AEC Grade: N/A; Supplier Part Number 1: 478-1201-1-ND; Technology: Ceramic; ComponentLink1URL: http://datasheets.avx.com/X7RDielectric.pdf
C22-C25 C30 C31 = CMP-0007475-4: CAP, CERM, 2200 pF, 100 V, +/- 10%, X7R, 0603; Manufacturer: MuRata; TaMin_C: -55°C; Polarized: N; SizeAreaWB_mm2: 4.68; Value1: Unknown; U/M: EA; Value: 2200pF; TaMax_C: 125°C; SizeZ_mm: 1; SizeX_mm: 1.6; SizeY_mm: 0.8; Cap_Case: 0603; Value2: 100V; SizeArea_mm2: 1.28; CompType: Capacitor; Cap_F: 2.2nF; AEC Category: Q200; Supplier Part Number 2: 81-GRM188R72A222KA01; Publisher: Texas Instruments; Supplier 2: Mouser; TempCo: X7R; Published: 2008-06-19; RoHS: Y; MountType: SMT; Supplier 1: Digi-Key; PackageReference: 0603; Tolerance_%: 10%; LatestRevisionDate: 2017-03-09; PartNumber: GRM188R72A222KA01D; AEC Qualified: ?; ComponentLink1Description: Datasheet link; Supplier Part Number 1: 490-1478-1-ND; Technology: Ceramic; ComponentLink1URL: http://search.murata.co.jp/Ceramy/PnsearchViewAction.do?HnOFG=ON&HnNFG=ON&SEL_CNT=50&sLang=en&sKey=GRM188R72A222KA01D&x=9&y=9&search=startwith
C33 C34 = CMP-0006857-4: CAP, CERM, 0.1 uF, 16 V, +/- 5%, X7R, 0603; Manufacturer: Kemet; Polarized: N; CompType: Capacitor; Value: 0.1uF; U/M: EA; Cap_F: 100nF; Value1: Unknown; VDC_V: 16V; TaMin_C: -55°C; TaMax_C: 125°C; Cap_Case: 0603; AEC Category: Q200; SizeArea_mm2: 1.28; SizeAreaWB_mm2: 4.68; SizeX_mm: 1.6; SizeY_mm: 0.8; SizeZ_mm: 1; PartNumber: C0603C104J4RACTU; PackageReference: 0603; RoHS: Y; Tolerance_%: 5%; Value2: 16V; MountType: SMT; Technology: Ceramic; TempCo: X7R; Published: 2008-06-19; Publisher: Texas Instruments; LatestRevisionDate: 2017-03-09; ComponentLink1Description: Datasheet link; ComponentLink1URL: http://www.kemet.com/kemet/web/homepage/kechome.nsf/vapubfiles/F3102_Y5V.pdf/$file/F3102_Y5V.pdf; Supplier 1: Digi-Key; Supplier Part Number 1: 399-1097-1-ND; Supplier 2: Mouser; Supplier Part Number 2: 80-C0603C104J4R; Supplier 3: Farnell; Supplier Part Number 3: 1650834; AEC Qualified: ?
D8 D9 D12 D13 D16 D18 = CMP-0076923-3: Diode, Schottky, 40 V, 2 A, SMA; Manufacturer: Vishay-Semiconductor; Io_A: 2A; SizeAreaWB_mm2: 37.3428; Value: 40V; SizeY_mm: 2.92; AEC Qualified: N; SizeX_mm: 5.59; Green_Lifecycle: Not Set; SizeArea_mm2: 16.3228; Value2: 0.49V; RJC_CperW: 28.0; AEC Category: Q101; Green_REACh: Incomplete; Vf_V: 490mV; TJmax_C: 150°C; SizeZ_mm: 2.87; CompType: Diode; ComponentLink1Description: Datasheet link; PackageReference: SMA; RoHS: Y; Green_EU RoHS: Incomplete; Vr_V: 40V; PartNumber: SSA24-E3/61T; ComponentLink1URL: http://www.vishay.com/docs/88882/ssa23l.pdf; Green_EU RoHS-2: Incomplete; Value1: 2A; MountType: SMT; Type: Schottky
D10 D11 D14 D15 D17 D19 = CMP-0005527-4: Diode, Zener, 16 V, 1 W, SMA; Manufacturer: Diodes Inc.; Value: 16V; RJA_CperW: 100; SizeY_mm: 2.92; AEC Category: Q101; SizeAreaWB_mm2: 37.3428; SizeX_mm: 5.59; AEC Qualified: N; SizeArea_mm2: 16.3228; SizeZ_mm: 2.87; Value1: 1W; MountType: SMT; ComponentLink1URL: http://www.diodes.com/_files/datasheets/ds18015.pdf; PartNumber: SMAZ16-13-F; CompType: Zener; PackageReference: SMA; Vz_V: 16V; RoHS: Y; ComponentLink1Description: Datasheet link; Power_W: 1W
GHA GHB GHC GLA GLB GLC SHA SHB SHC = CMP-0055139-1: Test Point, Miniature, White, TH; Manufacturer: Keystone; ContactFinish: Silver; CNHeader: FALSE; CT: TRUE; Green_Lifecycle: Active; Green_REACh: Passed; PartNumber: 5002; PackageReference: White Miniature Testpoint; CompType: Test Point; RoHS: Y; MountType: TH; ComponentLink1Description: Datasheet URL; ComponentLink1URL: http://www.keyelco.com/userAssets/file/M60-2p60.pdf; Publisher: Texas Instruments; LatestRevisionDate: 26/05/2017; Supplier 1: Digi-Key; Supplier Part Number 1: 36-5002-ND; Supplier 2: Newark; Supplier Part Number 2: 82H9632; Supplier 3: Mouser; Supplier Part Number 3: 534-5002; Color: White; Green_EU RoHS-2: Passed; Green_EU RoHS: Passed
J5 = CMP-0055528-1: Terminal Block, 9.52mm, 3x1, R/A, TH; PartNumber: 1904150; Manufacturer: Phoenix Contact; Pitch_mm: 9.52; Gender: Female; Row_Count: 1; Current_A: 32A; Voltage_V: 1kV; Cert_UL: Y; CNHeader: FALSE; CT: TRUE; PackageReference: Terminal Block, 3x1, Pitch 9.52mm; CompType: Terminal Block; RoHS: Y; MountType: TH; ComponentLink1Description: Datasheet URL; ComponentLink1URL: https://www.phoenixcontact.com/online/portal/in?uri=pxc-oc-itemdetail:pid=1904150&library=inen&pcck=P-11-01-05&tab=1; Publisher: Texas Instruments; LatestRevisionDate: 26/05/2017; Supplier 1: Digi-Key; Supplier Part Number 1: 277-6184-ND; Supplier 2: Newark; Supplier Part Number 2: 15X2516; Supplier 3: Mouser; Supplier Part Number 3: 651-1904150; Orientation: R/A; PinCount: 3; Color: Green; Cert_VDE: Y
NT1-NT6 = CMP-0078142-4: Single point connection between nets.; MountType: SMT; PackageReference: N/A; CompType: Net-Tie; Manufacturer: N/A; PartNumber: N/A; Library Reference: Net-Tie
Q1-Q6 = CMP-0000958-3: MOSFET, N-CH, 100 V, 17 A, DNK0008A (VSON-CLIP-8); Manufacturer: Texas Instruments; Alternate Manufacturer: None; U/M: EA; ChType: N; Value: 100V; Value2: 48 nC; QgTyp_nC: 48; Vgs_V: 20V; IdsMax_A: 17A; SizeAreaWB_mm2: 56; SizeArea_mm2: 30; SizeX_mm: 6; SizeY_mm: 5; SizeZ_mm: 1; AEC Category: Q101; CompType: MOSFET; PartNumber: CSD19532Q5B; PackageReference: DNK0008A; VdsMax_V: 100V; RoHS: Y; MountType: SMT; ComponentLink1Description: Datasheet link; ComponentLink1URL: http://www.ti.com/lit/ds/symlink/csd19532q5b.pdf; Supplier 1: Digi-Key; Supplier Part Number 1: 296-37478-6-ND; Supplier 2: Farnell; Supplier Part Number 2: 2413268; AEC Qualified: N
R27 R28 R39 R40 R51 R57 = CMP-0020617-3: RES, 10, 5%, 0.125 W, AEC-Q200 Grade 0, 0805; Manufacturer: Panasonic; Power_W: 125mW; TempCo: 200 ppm/C; Value_Code: 10R0; Value: 10; EIA_Code: E24; SizeX_mm: 2; SizeY_mm: 1.25; SizeZ_mm: 1.45; Value2: 0.125W; SizeArea_mm2: 2.5; AEC Qualified: Y; VDC_V: 150V; AEC Category: Q200; AEC Grade: 0; SizeAreaWB_mm2: 6.75; Supplier Part Number 2: 667-ERJ-6GEYJ100V; Supplier 2: Mouser; Supplier Part Number 3: 2057667; Supplier 3: Farnell; RoHS: Y; Value1: 5%; MountType: SMT; Supplier 1: Digi-Key; PackageReference: 0805; Tolerance_%: 5%; Res_ohm: 10; CompType: Resistor; PartNumber: ERJ-6GEYJ100V; ComponentLink1Description: Datasheet link; Supplier Part Number 1: P10ACT-ND; Technology: Thick Film; ComponentLink1URL: https://industrial.panasonic.com/cdbs/www-data/pdf/RDA0000/AOA0000C301.pdf
R29 R30 R47 R48 R52 R62 = CMP-0020521-3: RES, 2.7, 5%, 0.125 W, AEC-Q200 Grade 0, 0805; Manufacturer: Vishay-Dale; Power_W: 125mW; TempCo: 200 ppm/C; Value_Code: 2R70; Value: 2.7; EIA_Code: E24; SizeX_mm: 2; SizeY_mm: 1.25; SizeZ_mm: 1.45; Value2: 0.125W; SizeArea_mm2: 2.5; AEC Qualified: Y; VDC_V: 150V; AEC Category: Q200; AEC Grade: 0; Supplier Part Number 2: 71-CRCW08052R70JNEA; Supplier 2: Mouser; Supplier Part Number 3: 1739195; Supplier 3: Farnell; RoHS: E; Value1: 5%; MountType: SMT; Supplier 1: Digi-Key; PackageReference: 0805; Tolerance_%: 5%; Res_ohm: 2.7; CompType: Resistor; PartNumber: CRCW08052R70JNEA; ComponentLink1Description: Datasheet link; Supplier Part Number 1: 541-2.7ACT-ND; Technology: Thick Film; ComponentLink1URL: http://www.vishay.com/docs/20035/dcrcwe3.pdf
R33 R34 R43 R44 R54 R59 = CMP-0020643-3: RES, 15, 5%, 0.125 W, AEC-Q200 Grade 0, 0805; Manufacturer: Panasonic; Power_W: 125mW; TempCo: 200 ppm/C; Value_Code: 15R0; Value: 15; EIA_Code: E24; SizeX_mm: 2; SizeY_mm: 1.25; SizeZ_mm: 1.45; Value2: 0.125W; SizeArea_mm2: 2.5; AEC Qualified: Y; VDC_V: 150V; AEC Category: Q200; AEC Grade: 0; SizeAreaWB_mm2: 6.75; Supplier Part Number 2: 667-ERJ-6GEYJ150V; Supplier 2: Mouser; Supplier Part Number 3: 2057671; Supplier 3: Farnell; RoHS: Y; Value1: 5%; MountType: SMT; Supplier 1: Digi-Key; PackageReference: 0805; Tolerance_%: 5%; Res_ohm: 15; CompType: Resistor; PartNumber: ERJ-6GEYJ150V; ComponentLink1Description: Datasheet link; Supplier Part Number 1: P15ACT-ND; Technology: Thick Film; ComponentLink1URL: https://industrial.panasonic.com/cdbs/www-data/pdf/RDA0000/AOA0000C301.pdf
R35 R36 R45 R46 R55 R61 = CMP-0021990-4: RES, 100 k, 1%, 0.1 W, AEC-Q200 Grade 0, 0603; Manufacturer: Vishay-Dale; Power_W: 100mW; TempCo: 100 ppm/C; Value: 100k; EIA_Code: E96; SizeX_mm: 1.6; SizeY_mm: 0.8; SizeZ_mm: 1; Value2: 0.1W; SizeArea_mm2: 1.28; AEC Qualified: Y; VDC_V: 75V; AEC Category: Q200; AEC Grade: 0; Supplier Part Number 2: 42K3668; Supplier 2: Newark; Supplier Part Number 3: 71-CRCW0603-100K-E3; Supplier 3: Mouser; Value_Code: 100k; RoHS: E; Value1: 1%; MountType: SMT; Supplier 1: Digi-Key; PackageReference: 0603; Tolerance_%: 1%; Res_ohm: 100k; CompType: Resistor; PartNumber: CRCW0603100KFKEA; ComponentLink1Description: Datasheet link; Supplier Part Number 1: 541-100KHCT-ND; Technology: Thick Film; ComponentLink1URL: http://www.vishay.com/docs/20035/dcrcwe3.pdf
R37 R38 R56 = CMP-0081973-1: RES, 0, 0%, 0.25 W, AEC-Q200 Grade 0, 0603; Manufacturer: Vishay-Dale; SizeAreaWB_mm2: 4.68; SizeArea_mm2: 1.28; AEC Qualified: Y; AEC Category: Q200; Value: 0; SizeZ_mm: 1; SizeY_mm: 0.8; Power_W: 250mW; Value2: 0.25W; SizeX_mm: 1.6; ComponentLink1Description: Datasheet link; RoHS: Y; Tolerance_%: 0%; Value_Code: 0; Supplier 1: Digi-Key; PackageReference: 0603; Technology: Thick Film; Res_ohm: 0; PartNumber: RCS06030000Z0EA; Supplier Part Number 2: 71-RCS06030000Z0EA; Supplier 2: Mouser; AEC Grade: 0; ComponentLink1URL: http://www.vishay.com/docs/20065/rcse3.pdf; Value1: 0%; CompType: Resistor; MountType: SMT; Supplier Part Number 1: 541-2779-1-ND
R49 R50 R63 = CMP-0015750-2: RES, 0.003, 1%, 3 W, AEC-Q200 Grade 0, 2512; Manufacturer: Bourns; Power_W: 3W; TempCo: 50 ppm/C; Value_Code: 3L000; U/M: EA; Value: 0.003; EIA_Code: E96; Res_ohm: 3m; SizeX_mm: 6.45; SizeY_mm: 3.35; SizeZ_mm: 0.9; SizeArea_mm2: 21.6075; AEC Qualified: Y; AEC Grade: 0; AEC Category: Q200; Supplier Part Number 2: 78X4870; Publisher: Texas Instruments; Supplier 2: Newark; Supplier Part Number 3: 652-CRE2512FZR003E-3; Supplier 3: Mouser; Published: 2008-06-26; RoHS: Y; Value1: 1%; MountType: SMT; Supplier 1: Digi-Key; PackageReference: 2512; Tolerance_%: 1%; Value2: 3W; CompType: Resistor; LatestRevisionDate: 2017-03-09; PartNumber: CRE2512-FZ-R003E-3; ComponentLink1Description: Datasheet link; Supplier Part Number 1: CRE2512-FZ-R003E-3CT-ND; Technology: Metal Film; ComponentLink1URL: http://www.bourns.com/docs/Product-Datasheets/CRE.pdf
R60 = CMP-0025697-4: as R5 on sheet MD029A_DRV8300; CompType: Resistor; PartNumber: CRCW06030000Z0EA; PackageReference: 0603; RoHS: E; Res_ohm: 0; Tolerance_%: 5%; Value1: 5%; MountType: SMT; Technology: Thick Film; ComponentLink1Description: Datasheet link; ComponentLink1URL: http://www.vishay.com/docs/20035/dcrcwe3.pdf; Supplier 1: Digi-Key; Supplier Part Number 1: 541-0.0GCT-ND; Supplier 2: Newark; Supplier Part Number 2: 52K8014; Supplier 3: Mouser; Supplier Part Number 3: 71-CRCW0603-0-E3; ValueDisplayed: 0; AEC Grade: 0
TP1 TP2 TP16 = CMP-0003825-1: 1mm Test Point, SMT; Manufacturer: Any; ComponentLink1URL: https://sps06.itg.ti.com/sites/KMS/crossdivteams/altium/docs/ComponentDatasheets/PROBE_TEST_POINT.png; Key: TP_SM_1MM; Publisher: Texas Instruments; CompType: Test Point; PackageReference: 1mm Test Point, SMT; LatestRevisionDate: 2017-03-09; MountType: SMT; PartNumber: TP_SM_1MM; ComponentLink1Description: Datasheet Link
U6 = CMP-0088337-2: Temperature Sensor Analog, Local -40°C ~ 150°C 10mV/°C SOT-23-3; Manufacturer: Texas Instruments; Accuracy: 0.5%; AEC Qualified: No; Operating Supply Current: 9uA; Sensor Output: Analog Voltage; TJmax_C: +150°C; SizeZ_mm: 1.12mm; Max Supply Voltage: 5.5V; Standoff Height: 0.01mm; Min Supply Voltage: 2.3V; AEC Category: Q200; CompType: IC; Datasheet Path: datasheets/IC_TMP235A2DBZR.pdf; TaMin_C: -40°C; Digikey Part Number: 296-TMP235A2DBZRCT-ND; ComponentLink1URL: http://www.ti.com/lit/ds/symlink/tmp235.pdf; Digikey Description: IC LOW-POWER HIGH-ACCURACY ANALOG O; RoHS: TRUE; Operating Temperature Range: -40°C to +150°C; PartNumber: TMP235A2DBZR; Lead Free: Yes; PackageReference: SOT-23; ComponentLink1Description: Datasheet; datasheet: http://www.ti.com/lit/ds/symlink/tmp235.pdf; Mouser Part Number: 595-TMP235A2DBZR; TaMax_C: +150°C; Mouser Description: ±2°C Analog output temperature sensor, with 10mV /°C gain 3-SOT-23 -40 to 150; helpURL: https://upverter.com/upn/revision/8cd7d823f9331d87/; ComponentLink2Description: Product Folder; ComponentLink2URL: http://www.ti.com/product/GPN; ComponentLink3Description: Online Datasheet; ComponentLink3URL: http://www.ti.com/product/GPN/datasheet; Part Number: TMP235A2DBZR